# Altium schematic sheet main.SchDoc
size A3
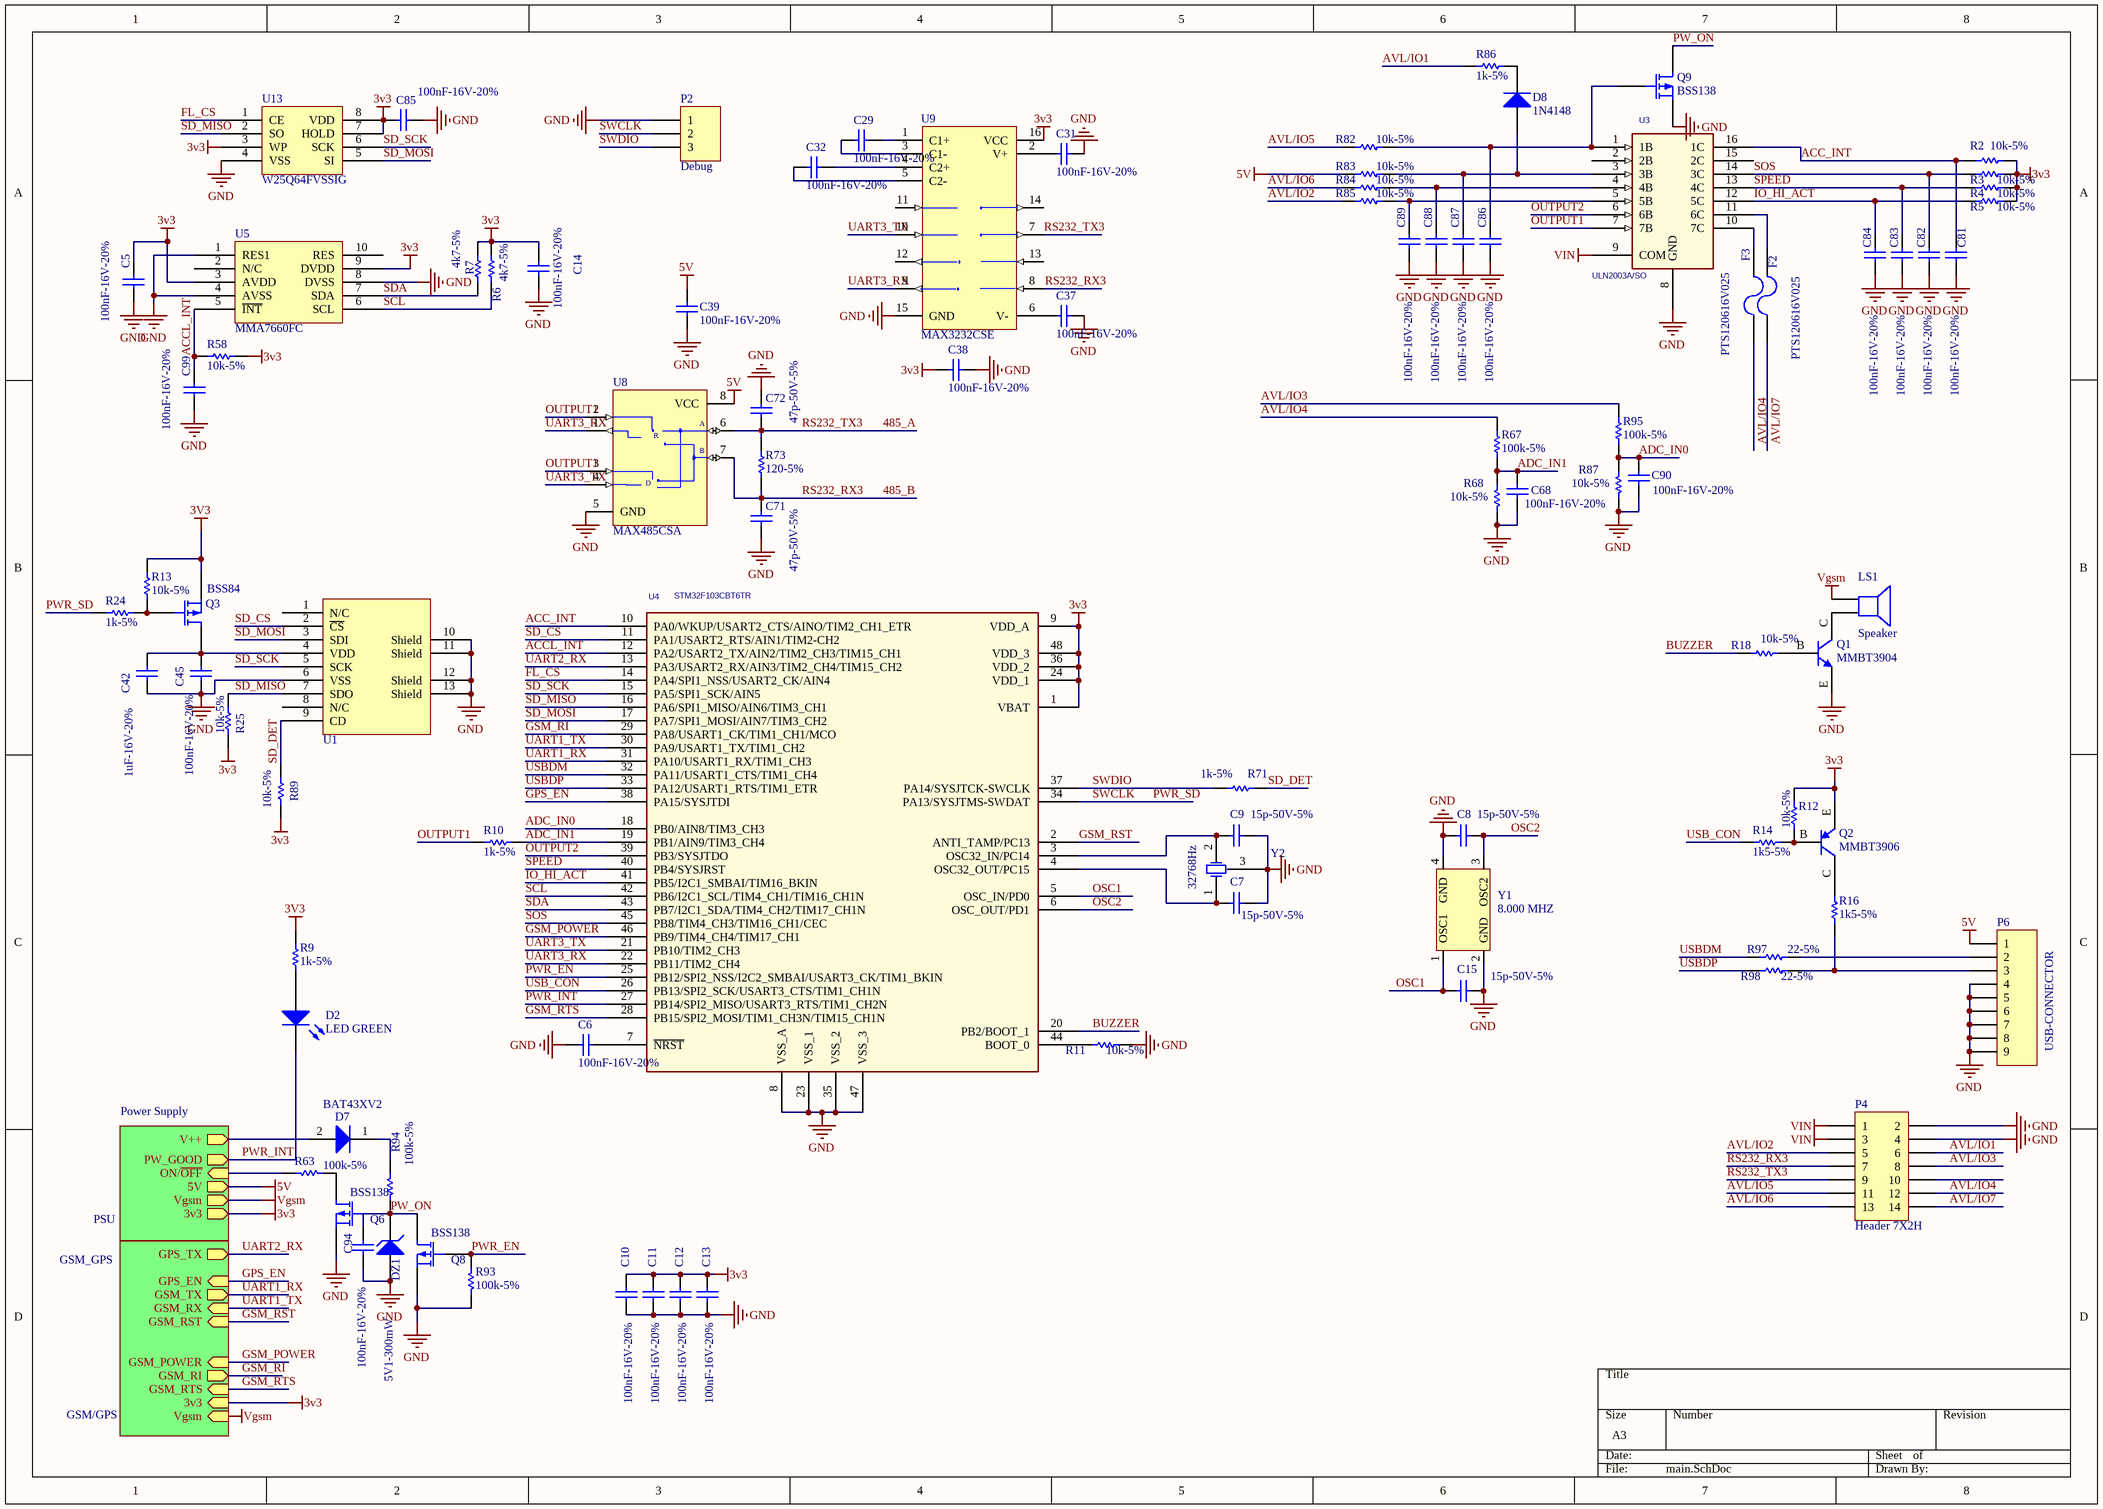
[diagram p0: main.SchDoc]

## Parts
C5  100nF-16V-20%  [C0402]
C6  100nF-16V-20%  [C0402]
C7  15p-50V-5%  [C0402]
C8  15p-50V-5%  [C0402]
C9  15p-50V-5%  [C0402]
C10  100nF-16V-20%  [C0402]
C11  100nF-16V-20%  [C0402]
C12  100nF-16V-20%  [C0402]
C13  100nF-16V-20%  [C0402]
C14  100nF-16V-20%  [C0402]
C15  15p-50V-5%  [C0402]
C29  100nF-16V-20%  [C0402]
C31  100nF-16V-20%  [C0402]
C32  100nF-16V-20%  [C0402]
C37  100nF-16V-20%  [C0402]
C38  100nF-16V-20%  [C0402]
C39  100nF-16V-20%  [C0402]
C42  1uF-16V-20%  [C0603]
C45  100nF-16V-20%  [C0402]
C68  100nF-16V-20%  [C0402]
C71  47p-50V-5%  [C0402]
C72  47p-50V-5%  [C0402]
C81  100nF-16V-20%  [C0402]
C82  100nF-16V-20%  [C0402]
C83  100nF-16V-20%  [C0402]
C84  100nF-16V-20%  [C0402]
C85  100nF-16V-20%  [C0402]
C86  100nF-16V-20%  [C0402]
C87  100nF-16V-20%  [C0402]
C88  100nF-16V-20%  [C0402]
C89  100nF-16V-20%  [C0402]
C90  100nF-16V-20%  [C0402]
C94  100nF-16V-20%  [C0402]
C99  100nF-16V-20%  [C0402]
D2  LED GREEN  [LED0603-G]
D7  BAT43XV2  [SOD-523F]
D8  1N4148  [SOD323]
DZ1  5V1-300mW  [SOD323]
F2  PTS120616V025  [PTC1206]
F3  PTS120616V025  [PTC1206]
LS1  Speaker  [BUZZER]
P2  Debug  [HDR1X3]
P4  Header 7X2H  [HDR_7x2]
P6  USB-CONNECTOR  [USB MINI B RECEPTACLE-M]
Q1  MMBT3904  [SC-43-BCE]
Q2  MMBT3906  [SC-43-BCE]
Q3  BSS84  [SOT23-3]
Q6  BSS138  [SOT23-3]
Q8  BSS138  [SOT23-3]
Q9  BSS138  [SOT23-3]
R2  10k-5%  [R0402]
R3  10k-5%  [R0402]
R4  10k-5%  [R0402]
R5  10k-5%  [R0402]
R6  4k7-5%  [R0402]
R7  4k7-5%  [R0402]
R9  1k-5%  [R0402]
R10  1k-5%  [R0402]
R11  10k-5%  [R0402]
R12  10k-5%  [R0402]
R13  10k-5%  [R0402]
R14  1k5-5%  [R0402]
R16  1k5-5%  [R0402]
R18  10k-5%  [R0402]
R24  1k-5%  [R0402]
R25  10k-5%  [R0402]
R58  10k-5%  [R0402]
R63  100k-5%  [R0402]
R67  100k-5%  [R0402]
R68  10k-5%  [R0402]
R71  1k-5%  [R0402]
R73  120-5%  [R0603]
R82  10k-5%  [R0402]
R83  10k-5%  [R0402]
R84  10k-5%  [R0402]
R85  10k-5%  [R0402]
R86  1k-5%  [R0402]
R87  10k-5%  [R0402]
R89  10k-5%  [R0402]
R93  100k-5%  [R0402]
R94  100k-5%  [R0402]
R95  100k-5%  [R0402]
R97  22-5%  [R0402]
R98  22-5%  [R0402]
U1  uSD Push-Push Socket  [MICROSD SOCKET CPSDBT5]  (value not drawn)
U3  ULN2003A/SO  [SO16-150mil]
U4  STM32F103CBT6TR  [TQFP-48-P0.5]
U5  MMA7660FC  [MMA7660FC]
U8  MAX485CSA  [SO8-150mil]
U9  MAX3232CSE  [SO16-150mil]
U13  W25Q64FVSSIG  [SO8-200mil]
Y1  8.000 MHZ  [SMD CRYSTAL 4 x 2.5]
Y2  32768Hz  [Cylindrical crystal - small]

## Sub-sheets
GSM/GPS = GSM_GPS: GSM_POWER (in), GSM_RX (in), GSM_TX (out), Vgsm (in), GPS_TX (out), GSM_RI (out), GPS_EN (in), GSM_RST (in), GSM_RTS (in), 3v3 (in)
Power Supply = PSU: Vgsm (out), 3v3 (out), 5V (out), PW_GOOD (out), V++ (out), ON/~{OFF} (in)

## Nets
3v3: C5.2 C10.1 C11.1 C12.1 C13.1 C14.2 C38.1 C85.1 Q2.E Q3.2(S) R2.2 R3.2 R4.2 R5.2 R6.2 R7.2 R9.2 R12.2 R13.1 R25.1 R58.2 R89.1 U4.1(VBAT) U4.9(VDD_A) U4.24(VDD_1) U4.36(VDD_2) U4.48(VDD_3) U5.3(AVDD) U5.9(DVDD) U9.16(VCC) U13.3(WP) U13.7(HOLD) U13.8(VDD) ; sheet Power Supply/3v3, sheet GSM/GPS/3v3
5V: C39.1 P6.1 R83.2 U8.8(VCC) ; sheet Power Supply/5V
GND: C5.1 C6.2 C7.2 C8.1 C9.2 C10.2 C11.2 C12.2 C13.2 C14.1 C15.2 C31.2 C37.2 C38.2 C39.2 C42.2 C45.2 C68.1 C71.1 C72.2 C81.1 C82.1 C83.1 C84.1 C85.2 C86.1 C87.1 C88.1 C89.1 C90.1 C94.2 C99.1 DZ1.1(A) P2.1 P4.2 P4.4 P6.4 P6.5 P6.6 P6.7 P6.8 P6.9 Q1.E Q6.2(S) Q8.2(S) Q9.2(S) R11.1 R68.1 R87.1 R93.2 U1.6(VSS) U1.10(Shield) U1.11(Shield) U1.12(Shield) U1.13(Shield) U3.8(GND) U4.8(VSS_A) U4.23(VSS_1) U4.35(VSS_2) U4.47(VSS_3) U5.1(RES1) U5.4(AVSS) U5.8(DVSS) U8.5(GND) U9.15(GND) U13.4(VSS) Y1.2(GND) Y1.4(GND) Y2.3
Vgsm: LS1.1 ; sheet Power Supply/Vgsm, sheet GSM/GPS/Vgsm
VIN: P4.1 P4.3 U3.9(COM)
485_A: C72.1 P4.9 R73.2 U8.6(A) U9.7(T2OUT)  [also labelled RS232_TX3]
485_B: C71.2 P4.7 R73.1 U8.7(B) U9.8(R2IN)  [also labelled RS232_RX3]
ACC_INT: C81.2 R2.1 U3.16(1C) U4.10(PA0/WKUP/USART2_CTS/AINO/TIM2_CH1_ETR)
ACCL_INT: C99.2 R58.1 U4.12(PA2/USART2_TX/AIN2/TIM2_CH3/TIM15_CH1) U5.5(~{INT})
ADC_IN0: C90.2 R87.2 R95.2 U4.18(PB0/AIN8/TIM3_CH3)
ADC_IN1: C68.2 R10.1 R67.2 R68.2 U4.19(PB1/AIN9/TIM3_CH4)
AVL/IO1: P4.6 R86.2
AVL/IO2: P4.5 R85.2
AVL/IO3: P4.8 R95.1
AVL/IO4: F3.1 P4.12 R67.1
AVL/IO5: P4.11 R82.2
AVL/IO6: P4.13 R84.2
AVL/IO7: F2.1 P4.14
BUZZER: R18.2 U4.20(PB2/BOOT_1)
FL_CS: U4.14(PA4/SPI1_NSS/USART2_CK/AIN4) U13.1(CE)
GPS_EN: U4.38(PA15/SYSJTDI) ; sheet GSM/GPS/GPS_EN
GSM_POWER: U4.46(PB9/TIM4_CH4/TIM17_CH1) ; sheet GSM/GPS/GSM_POWER
GSM_RI: U4.29(PA8/USART1_CK/TIM1_CH1/MCO) ; sheet GSM/GPS/GSM_RI
GSM_RST: U4.2(ANTI_TAMP/PC13) ; sheet GSM/GPS/GSM_RST
GSM_RTS: U4.28(PB15/SPI2_MOSI/TIM1_CH3N/TIM15_CH1N) ; sheet GSM/GPS/GSM_RTS
IO_HI_ACT: C84.2 R5.1 U3.12(5C) U4.41(PB5/I2C1_SMBAI/TIM16_BKIN)
OSC1: C15.1 U4.5(OSC_IN/PD0) Y1.1(OSC1)
OSC2: C8.2 U4.6(OSC_OUT/PD1) Y1.3(OSC2)
OUTPUT1: R10.2 U3.7(7B) U8.2(~{RE}) U8.3(DE)
OUTPUT2: U3.6(6B) U4.39(PB3/SYSJTDO)
PW_ON: C94.1 DZ1.2(K) Q6.1(G) Q8.3(D) Q9.3(D) R94.2
PWR_EN: Q8.1(G) R93.1 U4.25(PB12/SPI2_NSS/I2C2_SMBAI/USART3_CK/TIM1_BKIN)
PWR_INT: D2.2(K) U4.27(PB14/SPI2_MISO/USART3_RTS/TIM1_CH2N) ; sheet Power Supply/PW_GOOD
PWR_SD: P2.2 R24.2 U4.34(PA13/SYSJTMS-SWDAT)  [also labelled SWCLK]
SCL: R6.1 U4.42(PB6/I2C1_SCL/TIM4_CH1/TIM16_CH1N) U5.6(SCL)
SD_CS: U1.2(~{CS}) U4.11(PA1/USART2_RTS/AIN1/TIM2-CH2)
SD_DET: R71.1 R89.2 U1.9(CD)
SD_MISO: R25.2 U1.7(SDO) U4.16(PA6/SPI1_MISO/AIN6/TIM3_CH1) U13.2(SO)
SD_MOSI: U1.3(SDI) U4.17(PA7/SPI1_MOSI/AIN7/TIM3_CH2) U13.5(SI)
SD_SCK: U1.5(SCK) U4.15(PA5/SPI1_SCK/AIN5) U13.6(SCK)
SDA: R7.1 U4.43(PB7/I2C1_SDA/TIM4_CH2/TIM17_CH1N) U5.7(SDA)
SOS: C82.2 R3.1 U3.14(3C) U4.45(PB8/TIM4_CH3/TIM16_CH1/CEC)
SPEED: C83.2 R4.1 U3.13(4C) U4.40(PB4/SYSJRST)
SWDIO: P2.3 R71.2 U4.37(PA14/SYSJTCK-SWCLK)
UART1_RX: U4.31(PA10/USART1_RX/TIM1_CH3) ; sheet GSM/GPS/GSM_TX
UART1_TX: U4.30(PA9/USART1_TX/TIM1_CH2) ; sheet GSM/GPS/GSM_RX
UART2_RX: U4.13(PA3/USART2_RX/AIN3/TIM2_CH4/TIM15_CH2) ; sheet GSM/GPS/GPS_TX
UART3_RX: U4.22(PB11/TIM2_CH4) U8.1(RO) U9.9(R2OUT)
UART3_TX: U4.21(PB10/TIM2_CH3) U8.4(DI) U9.10(T2IN)
USB_CON: R14.2 U4.26(PB13/SPI2_SCK/USART3_CTS/TIM1_CH1N)
USBDM: R97.1 U4.32(PA11/USART1_CTS/TIM1_CH4)
USBDP: R98.1 U4.33(PA12/USART1_RTS/TIM1_ETR)
NetC6_1: C6.1 U4.7(~{NRST})
NetC7_1: C7.1 U4.4(OSC32_OUT/PC15) Y2.1(OSC1)
NetC9_1: C9.1 U4.3(OSC32_IN/PC14) Y2.2(OSC2)
NetC29_1: C29.1 U9.3(C1-)
NetC29_2: C29.2 U9.1(C1+)
NetC31_1: C31.1 U9.2(V+)
NetC32_1: C32.1 U9.5(C2-)
NetC32_2: C32.2 U9.4(C2+)
NetC37_1: C37.1 U9.6(V-)
NetC42_1: C42.1 C45.1 Q3.3(D) U1.4(VDD)
NetC86_2: C86.2 Q9.1(G) R82.1 U3.1(1B)
NetC87_2: C87.2 D8.1(A) R83.1 U3.3(3B)
NetC88_2: C88.2 R84.1 U3.4(4B)
NetC89_2: C89.2 R85.1 U3.5(5B)
NetD2_1: D2.1(A) R9.1
NetD7_1: D7.1(K) R94.1
NetD7_2: D7.2(A) ; sheet Power Supply/V++
NetD8_2: D8.2(K) R86.1
NetF2_2: F2.2 U3.11(6C)
NetF3_2: F3.2 U3.10(7C)
NetLS1_2: LS1.2 Q1.C
NetP6_2: P6.2 R97.2
NetP6_3: P6.3 R16.2 R98.2
NetQ1_B: Q1.B R18.1
NetQ2_B: Q2.B R12.1 R14.1
NetQ2_C: Q2.C R16.1
NetQ3_1: Q3.1(G) R13.2 R24.1
NetQ6_3: Q6.3(D) R63.2
NetR11_2: R11.2 U4.44(BOOT_0)
NetR63_1: R63.1 ; sheet Power Supply/ON/~{OFF}

Not connected (* = marked no-connect by the designer): P4 10; U1 1(N/C) 8(N/C); U3 2(2B) 15(2C); U5 2(N/C) 10(RES); U9 11(T1IN) 12(R1OUT) 13(R1IN) 14(T1OUT)

## Notes on the sheet
- (in symbol MAX485CSA) R; D

## Library data of the parts
C5 C6 C10-C14 C29 C31 C32 C37-C39 C45 C68 C81-C90 C99 = Cap: CAP CER 0.1UF 16V Y5V 0402; Manufacturer: Yageo; Manufacturer Part Number: CC0402ZRY5V7BB104; Published: 8-Jun-2000; LatestRevisionDate: 17-Jul-2002; LatestRevisionNote: Re-released for DXP Platform.; PackageReference: C0402; Publisher: Altium Limited; Value: 100nF-16V-20%; Digi-Key Part Number: 311-1047-1-ND; Unit Price: 0.00250
C7-C9 C15 = Cap: CAP CER 15PF 50V 5% NPO 0402; Manufacturer: Yageo; Manufacturer Part Number: CC0402JRNPO9BN150; Published: 8-Jun-2000; LatestRevisionDate: 17-Jul-2002; LatestRevisionNote: Re-released for DXP Platform.; PackageReference: C0402; Publisher: Altium Limited; Value: 15p-50V-5%; Digi-Key Part Number: 311-1017-1-ND; Unit Price: 0.00270
C42 = Cap: CAP CER 1UF 16V Y5V 0603; Manufacturer: Yageo; Manufacturer Part Number: CC0603ZRY5V7BB105; Published: 8-Jun-2000; LatestRevisionDate: 17-Jul-2002; LatestRevisionNote: Re-released for DXP Platform.; PackageReference: C0603; Publisher: Altium Limited; Value: 1uF-16V-20%; Digi-Key Part Number: 311-1372-1-ND; Unit Price: 0.00465
C71 C72 = Cap: CAP CER 47PF 50V 5% NPO 0402; Manufacturer: Yageo; Manufacturer Part Number: CC0402JRNPO9BN470; Published: 8-Jun-2000; LatestRevisionDate: 17-Jul-2002; LatestRevisionNote: Re-released for DXP Platform.; PackageReference: C0603; Publisher: Altium Limited; Value: 47p-50V-5%; Digi-Key Part Number: 311-1021-1-ND; Unit Price: 0.00270
C94 = Cap: CAP CER 10000PF 16V 10% X7R 0402; Manufacturer: Yageo; Manufacturer Part Number: CC0402KRX7R7BB103; Published: 8-Jun-2000; LatestRevisionDate: 17-Jul-2002; LatestRevisionNote: Re-released for DXP Platform.; PackageReference: C0402; Publisher: Altium Limited; Value: 100nF-16V-20%; Digi-Key Part Number: 311-1042-2-ND; Unit Price: 0.00250
D2 = LED2: LED GREEN CLEAR THIN 0603 SMD; Manufacturer: Lite-On Inc; Manufacturer Part Number: LTST-C191KGKT; Published: 8-Jun-2000; LatestRevisionDate: 17-Jul-2002; LatestRevisionNote: Re-released for DXP Platform.; PackageVersion: Feb-2002; PackageReference: 3.2X1.6X1.1; Publisher: Altium Limited; Digi-Key Part Number: 160-1446-2-ND; Unit Price: 0.03780; Value: LED GREEN
D7 = Diode: Diode Type SMD; Manufacturer: Fairchild Semiconductor; Published: 8-Jun-2000; LatestRevisionDate: 17-Jul-2002; LatestRevisionNote: Re-released for DXP Platform.; PackageVersion: Sep-1996; PackageReference: SMC; Publisher: Altium Limited; Code_JEDEC: DO-214-AB; Value: BAT43XV2; Digi-Key Part Number: BAT43XV2CT-ND; Manufacturer Part Number: BAT43XV2; Unit Price: 0.01822
D8 = Diode: DIODE SWITCH 75V 200MW SOD323; Manufacturer Part Number: 1N4148WS-7-F; Manufacturer: Diodes Inc; Value: 1N4007; Description: DIODE GEN PURPOSE 1000V 1A SMA; Published: 8-Jun-2000; LatestRevisionDate: 17-Jul-2002; LatestRevisionNote: Re-released for DXP Platform.; PackageVersion: Sep-1996; PackageReference: DO-214-AA; Publisher: Altium Limited; Code_JEDEC: DO-214-AB; Digi-Key Part Number: 1N4148WS-FDITR-ND; Unit Price: 0.02933
DZ1 = D Zener: DIODE ZENER 5.1V 300MW SOD523; Manufacturer: NXP Semiconductors; Manufacturer Part Number: BZX585-B5V1,115; Published: 8-Jun-2000; LatestRevisionDate: 17-Jul-2002; LatestRevisionNote: Re-released for DXP Platform.; PackageReference: DIODE-0.7; Publisher: Altium Limited; Digi-Key Part Number: 568-6291-2-ND; Unit Price: 0.07840
F2 F3 = Fuse 2: PTC RESETTABLE SMD 1206 16V .25A; Manufacturer: Cooper Bussmann; Published: 8-Jun-2000; LatestRevisionDate: 17-Jul-2002; LatestRevisionNote: Re-released for DXP Platform.; PackageReference: PIN-W2/E2.8; Publisher: Altium Limited; Digi-Key Part Number: 283-3137-2-ND; Manufacturer Part Number: 120616V025; Unit Price: 0.12375; Value: PTS120616V025; tme part: SMD1815P050TF
LS1 = Speaker: Loudspeaker; Published: 24-Mar-1999; LatestRevisionDate: 17-Jul-2002; LatestRevisionNote: Re-released for DXP Platform.; PackageReference: PIN2; Publisher: Altium Limited
P2 = Header 3: NA; LatestRevisionDate: 17-Jul-2002; LatestRevisionNote: Re-released for DXP Platform.; Publisher: Altium Limited
P4 = Header 7X2H: Header, 7-Pin, Dual row, Right Angle; LatestRevisionDate: 17-Jul-2002; LatestRevisionNote: Re-released for DXP Platform.; Publisher: Altium Limited
P6 = Header 9: IO CONNECTOR; Manufacturer: NA; LatestRevisionDate: 17-Jul-2002; LatestRevisionNote: Re-released for DXP Platform.; Publisher: Altium Limited; Digi-Key Part Number: NA; Manufacturer Part Number: NA; Unit Price: 0.30000
Q1 = NPN Transistor: TRANSISTOR NPN GP 40V SOT23; Manufacturer: Micro Commercial Co; Manufacturer Part Number: MMBT3904-TP; Digi-Key Part Number: MMBT3904TPMSTR-ND; Unit Price: 0.02295
Q2 = PNP Transistor: TRANS SS PNP 40V 300MW SOT23; Manufacturer: Micro Commercial Co; Manufacturer Part Number: MMBT3906-TP; Unit Price: 0.02295; Digi-Key Part Number: MMBT3906-TPTR-ND
Q3 = MOSFET-P: MOSFET P-CH 50V 130MA SOT23-3; Manufacturer: Diodes Inc; Manufacturer Part Number: BSS84-7-F; Published: 8-Jun-2000; LatestRevisionDate: 17-Jul-2002; LatestRevisionNote: Re-released for DXP Platform.; PackageVersion: 1995/1996; PackageReference: E3; Publisher: Altium Limited; Digi-Key Part Number: BSS84-FDITR-ND; Unit Price: 0.06000
Q6 Q8 Q9 = MOSFET-P: MOSFET N-CH 50V 200MA SOT23-3; Manufacturer: Diodes Inc; Manufacturer Part Number: BSS138-7-F; Published: 8-Jun-2000; LatestRevisionDate: 17-Jul-2002; LatestRevisionNote: Re-released for DXP Platform.; PackageVersion: 1995/1996; PackageReference: E3; Publisher: Altium Limited; Digi-Key Part Number: BSS138-FDICT-ND; Unit Price: 0.06575
R2-R5 R11-R13 R18 R25 R58 R68 R82-R85 R87 R89 = Res1: RES 10K OHM 1/16W 5% 0402 SMD; Manufacturer: Yageo; Manufacturer Part Number: RC0402JR-0710KL; Description: RES 10K OHM 1/10W 5% 0603 SMD; Published: 8-Jun-2000; LatestRevisionDate: 17-Jul-2002; LatestRevisionNote: Re-released for DXP Platform.; PackageReference: R0603; Publisher: Altium Limited; Value: 10k-5%; Digi-Key Part Number: 311-10KJRCT-ND; Unit Price: 0.00178
R6 R7 = Res1: RES 4.7K OHM 1/16W 5% 0402 SMD; Manufacturer: Yageo; Manufacturer Part Number: RC0402JR-074K7L; Description: RES 10K OHM 1/10W 5% 0603 SMD; Published: 8-Jun-2000; LatestRevisionDate: 17-Jul-2002; LatestRevisionNote: Re-released for DXP Platform.; PackageReference: R0603; Publisher: Altium Limited; Value: 4k7-5%; Digi-Key Part Number: 311-4.7KJRCT-ND; Unit Price: 0.00178
R9 R10 R24 R71 R86 = Res1: RES 1.0K OHM 1/16W 5% 0402 SMD; Manufacturer: Yageo; Manufacturer Part Number: RC0402JR-071KL; Published: 8-Jun-2000; LatestRevisionDate: 17-Jul-2002; LatestRevisionNote: Re-released for DXP Platform.; PackageReference: R0603; Publisher: Altium Limited; Value: 1k-5%; Digi-Key Part Number: 311-1.0KJRCT-ND; Unit Price: 0.00178
R14 R16 = Res1: RES 1.5K OHM 1/16W 5% 0402 SMD; Manufacturer: Yageo; Manufacturer Part Number: RC0402JR-071K5L; Published: 8-Jun-2000; LatestRevisionDate: 17-Jul-2002; LatestRevisionNote: Re-released for DXP Platform.; PackageReference: R0603; Publisher: Altium Limited; Value: 1k5-5%; Digi-Key Part Number: 311-1.5KJRCT-ND; Unit Price: 0.00207
R63 R67 R93-R95 = Res1: RES 100K OHM 1/16W 5% 0402 SMD; Manufacturer: Yageo; Manufacturer Part Number: RC0402JR-07100KL; Published: 8-Jun-2000; LatestRevisionDate: 17-Jul-2002; LatestRevisionNote: Re-released for DXP Platform.; PackageReference: R0402; Publisher: Altium Limited; Value: 100k-5%; Digi-Key Part Number: 311-100KJRCT-ND; Unit Price: 0.00171
R73 = Res1: RES 120 OHM 1/10W 1% 0603 SMD; Manufacturer: Yageo; Manufacturer Part Number: RC0603FR-07120RL; Published: 8-Jun-2000; LatestRevisionDate: 17-Jul-2002; LatestRevisionNote: Re-released for DXP Platform.; PackageReference: R0603; Publisher: Altium Limited; Value: 120-5%; Digi-Key Part Number: 311-120HRTR-ND; Unit Price: 0.00207
R97 R98 = Res1: RES 22 OHM 1/16W 5% 0402 SMD; Manufacturer: Yageo; Manufacturer Part Number: RC0402JR-0722RL; Published: 8-Jun-2000; LatestRevisionDate: 17-Jul-2002; LatestRevisionNote: Re-released for DXP Platform.; PackageReference: R0402; Publisher: Altium Limited; Value: 22-5%; Digi-Key Part Number: 311-22JRCT-ND; Unit Price: 0.00178
U3 = ULN2003A/SO_0: IC DARL TRANS ARRAY 16-SOIC; Manufacturer Part Number: ULN2003ADR; Manufacturer: Texas Instruments; Digi-Key Part Number: 296-1368-2-ND; Unit Price: 0.144
U4 = ATmega128_4: MCU ARM 128K FLASH/TIMER; Manufacturer: STMicroelectronics; Digi-Key Part Number: 497-6288-ND; Manufacturer Part Number: STM32F103CBT6TR; Unit Price: 2
U5 = MMA7660FC: ACCELEROMETER 3X3 DGTL 10-DFN; Manufacturer: Freescale Semiconductor; Manufacturer Part Number: MMA7660FCT; Unit Price: 0.67000; Digi-Key Part Number: MMA7660FCT-ND
U8 = MAX485CSA: IC TXRX RS485/RS422 LOWPWR 8SOIC; Manufacturer: Maxim Integrated Products; Manufacturer Part Number: MAX485CSA+; Published: 16-Jan-2001; LatestRevisionDate: 13-Apr-2006; LatestRevisionNote: IPC-7351 Footprint Added.; DatasheetVersion: Feb-1996; PackageReference: NSO8; Publisher: Altium Limited; PackageDescription: 8-Pin Small Outline Integrated Circuit 1.27 mm Pitch; Code_JEDEC: MS-012-AA; Code_IPC: SOIC127P600-8; ComponentLink1Description: Manufacturer Link; ComponentLink1URL: http://www.maxim-ic.com/; ComponentLink2Description: Datasheet; ComponentLink2URL: http://pdfserv.maxim-ic.com/en/ds/MAX1487-MAX491.pdf; Digi-Key Part Number: MAX485CSA+-ND; Unit Price: 1.37762
U9 = MAX3232CSE: IC DRVR/RCVR MULTCH RS232 16SOIC; Manufacturer: Texas Instruments; Manufacturer Part Number: MAX3232IDR; Published: 16-Jan-2001; LatestRevisionDate: 13-Apr-2006; LatestRevisionNote: IPC-7351 Footprint Added.; DatasheetVersion: Mar-1999; PackageReference: NSO16; Publisher: Altium Limited; PackageDescription: 16-Pin Small Outline Integrated Circuit 1.27 mm Pitch; Code_JEDEC: MS-012-AC; Code_IPC: SOIC127P600-16; ComponentLink1Description: Manufacturer Link; ComponentLink1URL: http://www.maxim-ic.com/; ComponentLink2Description: Datasheet; ComponentLink2URL: http://pdfserv.maxim-ic.com/en/ds/MAX3222-MAX3241.pdf; Digi-Key Part Number: 296-13098-1-ND; Unit Price: 0.51383
U13 = FlashIC: IC FLASH 64MBIT 104MHZ 8SOIC; Manufacturer: Tyrone; Manufacturer: Winbond Electronics; Digi-Key Part Number: W25Q64FVSSIG-ND; Manufacturer Part Number: W25Q64FVSSIG; Unit Price: 1.39392
Y1 = CRYSTAL-SMT: CRYSTAL 8.000 MHZ 18PF SMD; Manufacturer: TXC CORPORATION; Manufacturer Part Number: 7B-8.000MAAJ-T; Digi-Key Part Number: 887-1452-2-ND; Unit Price: 0.39000; Value: 8.000 MHZ
Y2 = XTAL: CRYSTAL 32.000 KHZ 12.5PF CYL; Manufacturer: Citizen Finetech Miyota; Manufacturer Part Number: CFV206-32.000KAZF-UB; Published: 8-Jun-2000; LatestRevisionDate: 17-Jul-2002; LatestRevisionNote: Re-released for DXP Platform.; PackageReference: R38; Publisher: Altium Limited; Digi-Key Part Number: 300-8402-ND; Unit Price: 0.11